# Altium project AINGF_V2.PrjPcb (part 2 of 2)

## Sheet FT2232D.SchDoc: FT2232D
size A; Revision: 04
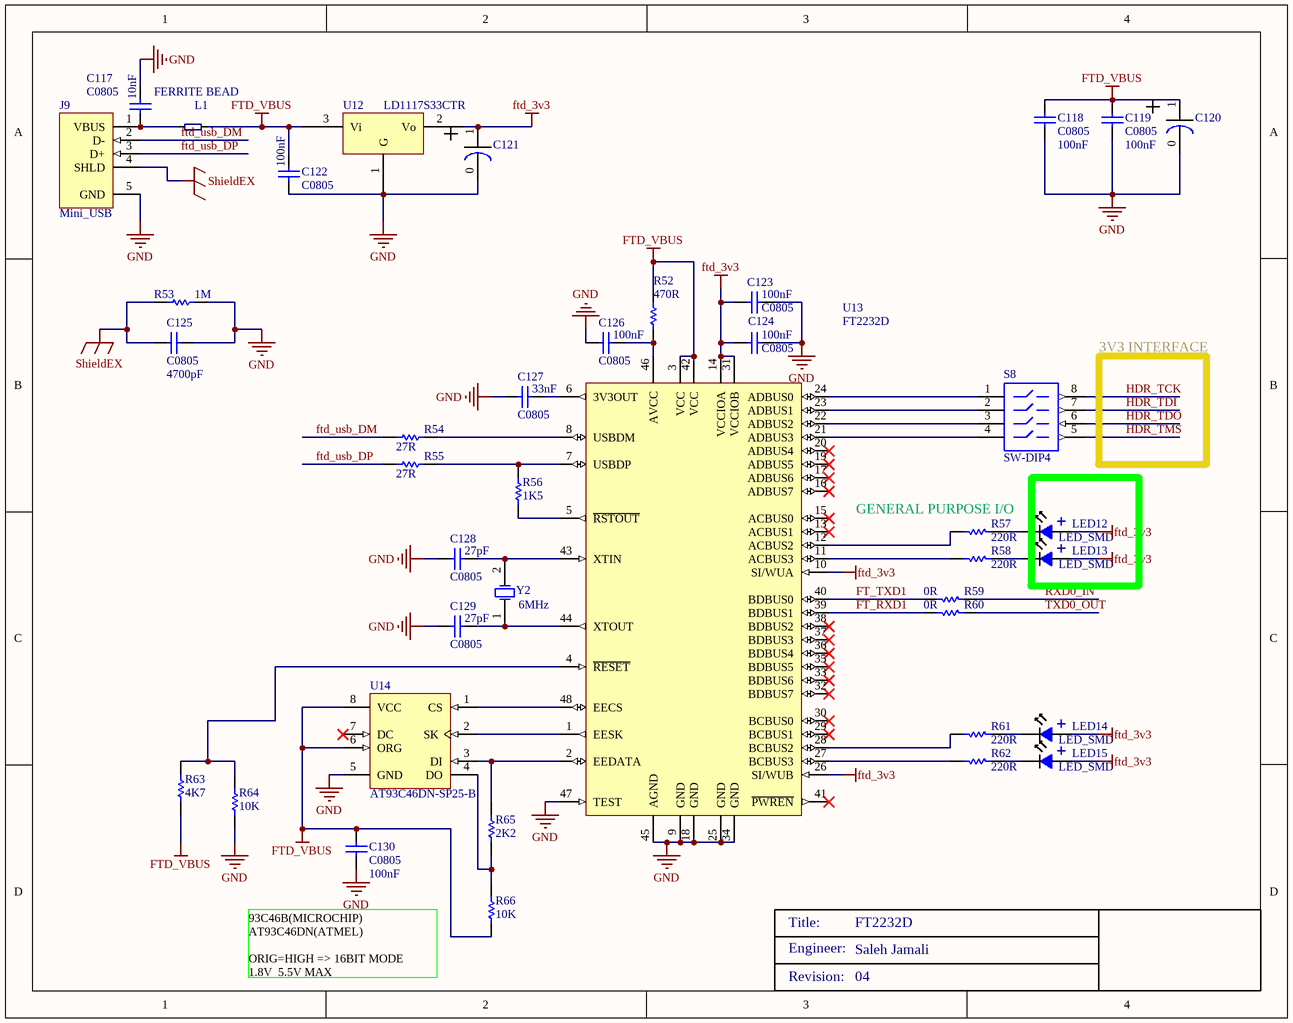
[diagram p14: FT2232D.SchDoc]

### Parts
C117  C0805  value 10nF  [0805]
C118  C0805  value 100nF  [0805]
C119  C0805  value 100nF  [0805]
C120  Electrolytic SMD Cap  [22_47u_10A]  (value not drawn)
C121  Electrolytic SMD Cap  [22_47u_10A]  (value not drawn)
C122  C0805  value 100nF  [0805]
C123  C0805  value 100nF  [0805]
C124  C0805  value 100nF  [0805]
C125  C0805  value 4700pF  [0805]
C126  C0805  value 100nF  [0805]
C127  C0805  value 33nF  [0805]
C128  C0805  value 27pF  [0805]
C129  C0805  value 27pF  [0805]
C130  C0805  value 100nF  [0805]
J9  Mini_USB  [My_USB]
L1  FERRITE BEAD  [smd_ferrite_1206]
LED12  LED_SMD  [LED_805]
LED13  LED_SMD  [LED_805]
LED14  LED_SMD  [LED_805]
LED15  LED_SMD  [LED_805]
R52  470R  [ERA-0805]
R53  1M  [ERA-0805]
R54  27R  [ERA-0805]
R55  27R  [ERA-0805]
R56  1K5  [ERA-0805]
R57  220R  [ERA-0805]
R58  220R  [ERA-0805]
R59  0R  [ERA-0805]
R60  0R  [ERA-0805]
R61  220R  [ERA-0805]
R62  220R  [ERA-0805]
R63  4K7  [ERA-0805]
R64  10K  [ERA-0805]
R65  2K2  [ERA-0805]
R66  10K  [ERA-0805]
S8  SW-DIP4  [DIP-8]
U12  LD1117S33CTR  [SOT223]
U13  FT2232D  [LQFP-48_M]
U14  AT93C46DN-SP25-B  [8S1_M]
Y2  6MHz  [HC-49U]

### Nets
ftd_3v3: C121.1 C123.1 C124.1 LED12.1 LED13.1 LED14.1 LED15.1 U12.2(Vo) U13.10(SI/WUA) U13.14(VCCIOA) U13.26(SI/WUB) U13.31(VCCIOB)
FTD_VBUS: C118.2 C119.2 C120.1 C122.1 C130.2 L1.1 R52.1 R63.1 R66.1 U12.3(Vi) U13.3(VCC) U13.42(VCC) U14.6(ORG) U14.8(VCC)
GND: C117.1 C118.1 C119.1 C120.0 C121.0 C122.2 C123.2 C124.2 C125.2 C126.1 C127.1 C128.1 C129.1 C130.1 J9.5(GND) R53.1 R64.1 U12.1(G) U13.9(GND) U13.18(GND) U13.25(GND) U13.34(GND) U13.45(AGND) U13.47(TEST) U14.5(GND)
ShieldEX: C125.1 J9.4(SHLD) R53.2
FT_RXD1: R60.2 U13.39(BDBUS1)
FT_TXD1: R59.2 U13.40(BDBUS0)
ftd_usb_DM: J9.2(D-) R54.2
ftd_usb_DP: J9.3(D+) R55.2
HDR_TCK: S8.8
HDR_TDI: S8.7
HDR_TDO: S8.6
HDR_TMS: S8.5
RXD0_IN: R59.1
TXD0_OUT: R60.1
NetC117_2: C117.2 J9.1(VBUS) L1.0
NetC126_2: C126.2 R52.2 U13.46(AVCC)
NetC127_2: C127.2 U13.6(3V3OUT)
NetC128_2: C128.2 U13.43(XTIN) Y2.2(OSC2)
NetC129_2: C129.2 U13.44(XTOUT) Y2.1(OSC1)
NetLED12_2: LED12.2 R57.1
NetLED13_2: LED13.2 R58.1
NetLED14_2: LED14.2 R61.1
NetLED15_2: LED15.2 R62.1
NetR54_1: R54.1 U13.8(USBDM)
NetR55_1: R55.1 R56.2 U13.7(USBDP)
NetR56_1: R56.1 U13.5(~{RSTOUT})
NetR57_2: R57.2 U13.12(ACBUS2)
NetR58_2: R58.2 U13.11(ACBUS3)
NetR61_2: R61.2 U13.28(BCBUS2)
NetR62_2: R62.2 U13.27(BCBUS3)
NetR63_2: R63.2 R64.2 U13.4(~{RESET})
NetR65_1: R65.1 R66.2 U14.4(DO)
NetR65_2: R65.2 U13.2(EEDATA) U14.3(DI)
NetS8_1: S8.1 U13.24(ADBUS0)
NetS8_2: S8.2 U13.23(ADBUS1)
NetS8_3: S8.3 U13.22(ADBUS2)
NetS8_4: S8.4 U13.21(ADBUS3)
NetU13_1: U13.1(EESK) U14.2(SK)
NetU13_48: U13.48(EECS) U14.1(CS)

Not connected (* = marked no-connect by the designer): U13 13(ACBUS1)* 15(ACBUS0)* 16(ADBUS7)* 17(ADBUS6)* 19(ADBUS5)* 20(ADBUS4)* 29(BCBUS1)* 30(BCBUS0)* 32(BDBUS7)* 33(BDBUS6)* 35(BDBUS5)* 36(BDBUS4)* 37(BDBUS3)* 38(BDBUS2)* 41(~{PWREN})*; U14 7(DC)*

### Notes on the sheet
- 3V3 INTERFACE
- (near R57) GENERAL PURPOSE I/O
- 93C46B(MICROCHIP)
  AT93C46DN(ATMEL)
  ORIG=HIGH => 16BIT MODE
  1.8V  5.5V MAX
- Engineer:
- Title:
- Saleh Jamali
- Revision:

### Library data of the parts
C117-C119 C122-C130 = C0805: Ceramic Chip Capacitor - Standard; Note: Footprint corresponds to dimensions for bulk cassette packaging. This case size has tightened tolerances.; Published: 17-Jul-2002; LatestRevisionDate: 19-Mar-2004; LatestRevisionNote: Silkscreen size reduced.; DatasheetDocument: Mar-2001; PackageDocument: Mar-2001; PackageReference: 0805; Publisher: Altium Limited; Code_JEITA: 0805; Code_IPC: 2012[0805]; ComponentLink1Description: Manufacturer Link; ComponentLink1URL: http://www.kemet.com/; ComponentLink2Description: Datasheet; ComponentLink2URL: http://www.kemet.com/kemet/web/homepage/kechome.nsf/vapubfilesname/F3102TA.pdf/$file/F3102TA.pdf
J9 = Mini_USB: USB 2.0, Right Angle, SMT, B Type, Receptacle, 5 Position, Black; ContactMaterial: Copper Alloy; ContactPlating: Gold (30); PCB_Layout: Complies with manufacturer's recommendation.; DrillSize: Corresponds to nominal value.; PanelGround: Without; Published: 15-Jul-2004; DatasheetDocument: 27-Jun-2003; PackageDocument: 27-Jun-2003; PackageReference: 440247; Publisher: Altium Limited; HousingMaterial: Thermoplastic; ComponentLink1Description: Manufacturer Link; ComponentLink1URL: http://www.tycoelectronics.com/; ComponentLink2Description: Packaging Specification; ComponentLink2URL: http://ecommas.tycoelectronics.com/commerce/DocumentDelivery/DDEController?Action=showdoc&DocId=Customer+Drawing%7F440247%7FD%7Fpdf%7FEnglish%7FC_440247_D.pdf
L1 = FERRITE BEAD: SIZE:
R52-R66 = ERA6Y: Rectangular Thick Film Chip Resistor, 10 Ohm to 1M Ohm Range, 0.1% and 0.5% Tolerance, 0805 Size, 0.1 W; Note: If flow soldering, adjust pad width of PCB Footprint to 0.7 - 0.8 times the width of the resistor.; Published: 17-Dec-2003; LatestRevisionDate: 19-Mar-2004; LatestRevisionNote: Silkscreen size reduced.; PackageDocument: Mar-2003; PackageReference: ERA-0805; Publisher: Altium Limited; Code_IPC: 2012 [0805]; ComponentLink1Description: Manufacturer Link; ComponentLink1URL: http://www.panasonic.com/industrial/components/resistive_products.htm; ComponentLink2Description: Datasheet; ComponentLink2URL: http://www.panasonic.com/industrial/components/pdf/AOA0000CE8.pdf
S8 = SW-DIP4: DIP Switch; Published: 24-Mar-1999; LatestRevisionDate: 17-Jul-2002; LatestRevisionNote: Re-released for DXP Platform.; PackageReference: DIP-8; Publisher: Altium Limited
U12 = LD1117S33CTR: 2.5 volt, 800mA Regulator
U13 = FT2232D: FT2232D Dual USB to Serial UART/FIFO IC, -40 to +85 degC, 48-pin LQFP; Manufacturer: FTDI; DatasheetVersion: ver 2.05, Apr-2011; PackageVersion: Apr-11; PackageReference: LQFP-48; PackageDescription: 48-Pin Thin Quad Flat Pack, 7 x 7 mm Body, 0.5 mm Pitch; PartNumber: FT2232D; ComponentLink1Description: Manufacturer URL; ComponentLink1URL: http://www.ftdichip.com/; ComponentLink2Description: Datasheet; ComponentLink2URL: http://www.ftdichip.com/Support/Documents/DataSheets/ICs/DS_FT2232D.pdf
U14 = AT93C46DN-SP25-B: 1Kbit (128 x 8 or 64 x 16), 3-wire Bus Serial Automotive EEPROM, 2.5V, 8-Pin SOIC, Bulk; DatasheetVersion: 8674B,  Oct-2009; PackageVersion: revC, Mar-2005; PackageReference: 8S1; PackageDescription: 8-Lead (0.150" Wide Body), Plastic Gull Wing Small Outline (JEDEC SOIC); Code_JEDEC: MS-012-AA; Code_IPC: SOIC127P600-8; ComponentLink1Description: Manufacturer URL; ComponentLink1URL: http://www.atmel.com/; ComponentLink2Description: Datasheet; ComponentLink2URL: http://www.atmel.com/dyn/resources/prod_documents/doc8674.pdf
Y2 = ECS-18-13-1: Crystal Oscillator; Published: 17-Jul-2002; DatasheetDocument: 18-Apr-2000; PackageReference: HC-49U; Publisher: Altium Limited; ComponentLink1Description: Manufacturer Link; ComponentLink1URL: http://www.ecsxtal.com/; ComponentLink2Description: Datasheet; ComponentLink2URL: http://www.ecsxtal.com/pdf2/HC49U.PDF
C120 C121 = Electrolytic SMD Cap: supplier: eshop.eca.ir

## Nets that join several sheets
1V2: PWR2 (C74.1 U4.2), FPGA1 (12 pins)
2V5: PWR2 (C76.1 R20.2 U5.2), FPGA1 (16 pins), FPGA2 (R1.1 R2.1)
3V3: PWR2 (C79.1 LED6.1 U6.4), FPGA1 (32 pins), FPGA2 (8 pins), FPGA3 (17 pins), USBFX2LP_4 (j7.0)
3V3_FX2: USBFX2LP_1 (5 pins), USBFX2LP_2 (9 pins), USBFX2LP_3 (R38.1 R41.1 R42.1), USBFX2LP_4 (20 pins)
3V3_SRAM: PWR2 (C82.1 LED7.1 U7.4), SRAM (12 pins), SRAM1 (12 pins)
GND: PWR1 (7 pins), PWR2 (17 pins), FPGA1 (60 pins), FPGA2 (18 pins), FPGA3 (19 pins), SRAM (13 pins), SRAM1 (13 pins), USBFX2LP_1 (9 pins), USBFX2LP_2 (9 pins), USBFX2LP_3 (10 pins), USBFX2LP_4 (23 pins), FT2232D (25 pins)
VIN_6: PWR1 (SW1.3 SW1.4), PWR2 (10 pins)
CLKOUT: FPGA6 (U1.180), USBFX2LP_1 (U2.100)
CTL0/FLAGA: FPGA6 (U1.189), USBFX2LP_1 (U2.54)
CTL1/FLAGB: FPGA6 (U1.187), USBFX2LP_1 (U2.55)
CTL2/FLAGC: FPGA6 (U1.185), USBFX2LP_1 (U2.56)
EEPROM_WP: USBFX2LP_2 (R33.2 R36.2 U10.7 U11.7), USBFX2LP_3 (R46.1)
FD0: FPGA6 (U1.200), USBFX2LP_3 (U2.34)
FD1: FPGA6 (U1.199), USBFX2LP_3 (U2.35)
FD2: FPGA6 (U1.198), USBFX2LP_3 (U2.36)
FD3: FPGA6 (U1.197), USBFX2LP_3 (U2.37)
FD4: FPGA6 (U1.196), USBFX2LP_3 (U2.44)
FD5: FPGA6 (U1.194), USBFX2LP_3 (U2.45)
FD6: FPGA6 (U1.191), USBFX2LP_3 (U2.46)
FD7: FPGA6 (U1.190), USBFX2LP_3 (U2.47)
FD8: FPGA6 (U1.175), USBFX2LP_3 (U2.80)
FD9: FPGA6 (U1.172), USBFX2LP_3 (U2.81)
FD10: FPGA6 (U1.171), USBFX2LP_3 (U2.82)
FD11: FPGA6 (U1.169), USBFX2LP_3 (U2.83)
FD12: FPGA6 (U1.168), USBFX2LP_3 (U2.95)
FD13: FPGA6 (U1.167), USBFX2LP_3 (U2.96)
FD14: FPGA6 (U1.166), USBFX2LP_3 (U2.97)
FD15: FPGA6 (U1.165), USBFX2LP_3 (U2.98)
FLASH_DO: FPGA2 (U3.1), FPGA3 (U1.92)
FPGA_INIT_B: FPGA2 (U3.8), FPGA3 (R11.2 U1.83)
HDR_TCK: FPGA2 (P1.6 R4.1 U3.6), FT2232D (S8.8)
HDR_TDI: FPGA2 (j1.0 j2.0 P1.10), FT2232D (S8.7)
HDR_TDO: FPGA2 (P1.8 U1.158), FT2232D (S8.6)
HDR_TMS: FPGA2 (P1.4 R5.1 U3.5), FT2232D (S8.5)
I2C_LK_BUS_CLK: FPGA3 (U1.81), USBFX2LP_3 (U2.67)
I2C_LK_BUS_D0: FPGA3 (U1.86), USBFX2LP_3 (U2.68)
I2C_LK_BUS_D1: FPGA3 (U1.87), USBFX2LP_3 (J6.1 U2.70)
IFCLK: FPGA6 (U1.184), USBFX2LP_1 (U2.26)
PA2/SLOE: FPGA6 (U1.183), USBFX2LP_3 (U2.69)
PA4/FIFOADR0: FPGA6 (U1.182), USBFX2LP_3 (U2.71)
PA5/FIFOADR1: FPGA6 (U1.181), USBFX2LP_3 (U2.72)
PA6/PKTEND: FPGA6 (U1.178), USBFX2LP_3 (U2.73)
PA7/FLAGD/SLCS: FPGA6 (U1.176), USBFX2LP_3 (U2.74)
RDY0/SLRD: FPGA6 (U1.162), USBFX2LP_1 (U2.3)
RDY1/SLWR: FPGA6 (U1.161), USBFX2LP_1 (U2.4)
RXD0_IN: USBFX2LP_1 (U2.41), FT2232D (R59.1)
SCL: USBFX2LP_1 (R29.1 U2.29), USBFX2LP_2 (U10.6 U11.6)
SDA: USBFX2LP_1 (R30.1 U2.30), USBFX2LP_2 (J_ROM_EN1.1)
SRAM0_A0: FPGA5 (U1.146), SRAM (U9.11)
SRAM0_A1: FPGA5 (U1.147), SRAM (U9.10)
SRAM0_A2: FPGA5 (U1.148), SRAM (U9.9)
SRAM0_A3: FPGA5 (U1.149), SRAM (U9.8)
SRAM0_A4: FPGA5 (U1.150), SRAM (U9.7)
SRAM0_A5: FPGA5 (U1.107), SRAM (U9.48)
SRAM0_A6: FPGA5 (U1.108), SRAM (U9.47)
SRAM0_A7: FPGA5 (U1.109), SRAM (U9.46)
SRAM0_A8: FPGA5 (U1.111), SRAM (U9.45)
SRAM0_A9: FPGA5 (U1.113), SRAM (U9.44)
SRAM0_A10: FPGA5 (U1.116), SRAM (U9.38)
SRAM0_A11: FPGA5 (U1.117), SRAM (U9.37)
SRAM0_A12: FPGA5 (U1.119), SRAM (U9.36)
SRAM0_A13: FPGA5 (U1.120), SRAM (U9.35)
SRAM0_A14: FPGA5 (U1.122), SRAM (U9.34)
SRAM0_A15: FPGA5 (U1.133), SRAM (U9.21)
SRAM0_A16: FPGA5 (U1.135), SRAM (U9.20)
SRAM0_A17: FPGA5 (U1.137), SRAM (U9.19)
SRAM0_A18: FPGA5 (U1.138), SRAM (U9.18)
SRAM0_A19: FPGA5 (U1.139), SRAM (U9.17)
SRAM0_BHE: FPGA5 (U1.144), SRAM (U9.12)
SRAM0_BLE: FPGA5 (U1.115), SRAM (U9.39)
SRAM0_CE2: FPGA5 (U1.140), SRAM (R26.1 U9.16)
SRAM0_D0: FPGA5 (U1.132), SRAM (U9.22)
SRAM0_D1: FPGA5 (U1.131), SRAM (U9.24)
SRAM0_D2: FPGA5 (U1.130), SRAM (U9.25)
SRAM0_D3: FPGA5 (U1.128), SRAM (U9.27)
SRAM0_D4: FPGA5 (U1.126), SRAM (U9.28)
SRAM0_D5: FPGA5 (U1.125), SRAM (U9.30)
SRAM0_D6: FPGA5 (U1.124), SRAM (U9.31)
SRAM0_D7: FPGA5 (U1.123), SRAM (U9.33)
SRAM0_D8: FPGA5 (U1.106), SRAM (U9.49)
SRAM0_D9: FPGA3 (U1.102), SRAM (U9.51)
SRAM0_D10: FPGA3 (U1.101), SRAM (U9.52)
SRAM0_D11: FPGA3 (U1.100), SRAM (U9.54)
SRAM0_D12: FPGA5 (U1.156), SRAM (U9.1)
SRAM0_D13: FPGA5 (U1.155), SRAM (U9.3)
SRAM0_D14: FPGA5 (U1.154), SRAM (U9.4)
SRAM0_D15: FPGA5 (U1.152), SRAM (U9.6)
SRAM0_nCE1: FPGA5 (U1.143), SRAM (R25.1 U9.13)
SRAM0_OE: FPGA5 (U1.114), SRAM (U9.42)
SRAM0_WE: FPGA5 (U1.141), SRAM (U9.15)
SRAM1_A0: FPGA4 (U1.15), SRAM1 (U8.11)
SRAM1_A1: FPGA4 (U1.16), SRAM1 (U8.10)
SRAM1_A2: FPGA4 (U1.18), SRAM1 (U8.9)
SRAM1_A3: FPGA4 (U1.19), SRAM1 (U8.8)
SRAM1_A4: FPGA4 (U1.20), SRAM1 (U8.7)
SRAM1_A5: FPGA4 (U1.33), SRAM1 (U8.48)
SRAM1_A6: FPGA4 (U1.34), SRAM1 (U8.47)
SRAM1_A7: FPGA4 (U1.35), SRAM1 (U8.46)
SRAM1_A8: FPGA4 (U1.36), SRAM1 (U8.45)
SRAM1_A9: FPGA4 (U1.37), SRAM1 (U8.44)
SRAM1_A10: FPGA4 (U1.42), SRAM1 (U8.38)
SRAM1_A11: FPGA4 (U1.43), SRAM1 (U8.37)
SRAM1_A12: FPGA4 (U1.44), SRAM1 (U8.36)
SRAM1_A13: FPGA4 (U1.45), SRAM1 (U8.35)
SRAM1_A14: FPGA4 (U1.46), SRAM1 (U8.34)
SRAM1_A15: FPGA4 (U1.3), SRAM1 (U8.21)
SRAM1_A16: FPGA4 (U1.4), SRAM1 (U8.20)
SRAM1_A17: FPGA4 (U1.5), SRAM1 (U8.19)
SRAM1_A18: FPGA4 (U1.7), SRAM1 (U8.18)
SRAM1_A19: FPGA4 (U1.9), SRAM1 (U8.17)
SRAM1_BHE: FPGA4 (U1.13), SRAM1 (U8.12)
SRAM1_BLE: FPGA4 (U1.40), SRAM1 (U8.39)
SRAM1_CE2: FPGA4 (U1.10), SRAM1 (R24.1 U8.16)
SRAM1_D0: FPGA4 (U1.2), SRAM1 (U8.22)
SRAM1_D1: FPGA6 (U1.205), SRAM1 (U8.24)
SRAM1_D2: FPGA6 (U1.204), SRAM1 (U8.25)
SRAM1_D3: FPGA6 (U1.203), SRAM1 (U8.27)
SRAM1_D4: FPGA4 (U1.52), SRAM1 (U8.28)
SRAM1_D5: FPGA4 (U1.51), SRAM1 (U8.30)
SRAM1_D6: FPGA4 (U1.50), SRAM1 (U8.31)
SRAM1_D7: FPGA4 (U1.48), SRAM1 (U8.33)
SRAM1_D8: FPGA4 (U1.31), SRAM1 (U8.49)
SRAM1_D9: FPGA4 (U1.29), SRAM1 (U8.51)
SRAM1_D10: FPGA4 (U1.28), SRAM1 (U8.52)
SRAM1_D11: FPGA4 (U1.27), SRAM1 (U8.54)
SRAM1_D12: FPGA4 (U1.26), SRAM1 (U8.1)
SRAM1_D13: FPGA4 (U1.24), SRAM1 (U8.3)
SRAM1_D14: FPGA4 (U1.22), SRAM1 (U8.4)
SRAM1_D15: FPGA4 (U1.21), SRAM1 (U8.6)
SRAM1_nCE1: FPGA4 (U1.12), SRAM1 (R23.1 U8.13)
SRAM1_OE: FPGA4 (U1.39), SRAM1 (U8.42)
SRAM1_WE: FPGA4 (U1.11), SRAM1 (U8.15)
TXD0_OUT: USBFX2LP_1 (U2.40), FT2232D (R60.1)
VBUS: USBFX2LP_1 (J5.1), USBFX2LP_3 (R37.1)